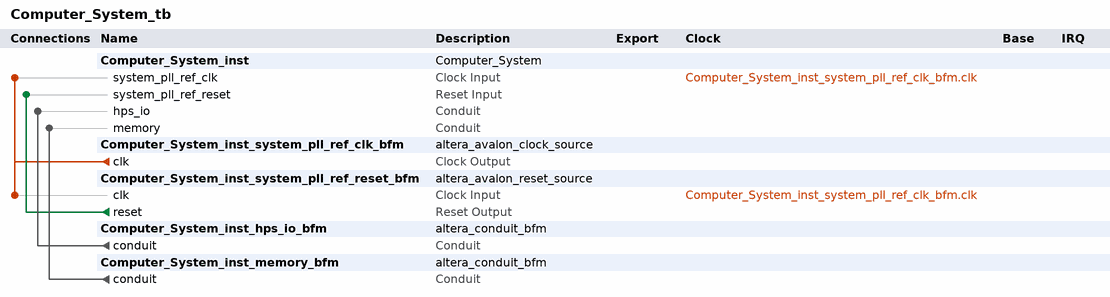
[diagram p0: system contents]
# Platform Designer (Qsys) system Computer_System_tb, Cyclone V 5CSEBA6U23I7
# Parameters at their usual value, and those the tool derives, are not listed.
package require -exact qsys 18.1
create_system Computer_System_tb
set_project_property DEVICE_FAMILY {Cyclone V}
set_project_property DEVICE 5CSEBA6U23I7

add_instance Computer_System_inst Computer_System 1.0

add_instance Computer_System_inst_system_pll_ref_clk_bfm altera_avalon_clock_source 18.1

add_instance Computer_System_inst_system_pll_ref_reset_bfm altera_avalon_reset_source 18.1
set_instance_parameter_value Computer_System_inst_system_pll_ref_reset_bfm ASSERT_HIGH_RESET 1
set_instance_parameter_value Computer_System_inst_system_pll_ref_reset_bfm INITIAL_RESET_CYCLES 50

add_instance Computer_System_inst_hps_io_bfm altera_conduit_bfm 18.1
set_instance_parameter_value Computer_System_inst_hps_io_bfm CLOCKED_SIGNAL false
set_instance_parameter_value Computer_System_inst_hps_io_bfm ENABLE_RESET false
set_instance_parameter_value Computer_System_inst_hps_io_bfm SIGNAL_DIRECTIONS input,bidir,output,output,output,output,output,output,input,input,input,input,input,input,bidir,bidir,bidir,bidir,bidir,bidir,bidir,bidir,bidir,bidir,input,bidir,bidir,bidir,bidir,bidir,input,output,input,input,output,input,output,bidir,bidir,bidir,bidir,bidir,bidir,bidir,bidir,output,output,input
set_instance_parameter_value Computer_System_inst_hps_io_bfm SIGNAL_ROLES hps_io_emac1_inst_MDC,hps_io_emac1_inst_MDIO,hps_io_emac1_inst_RXD0,hps_io_emac1_inst_RXD1,hps_io_emac1_inst_RXD2,hps_io_emac1_inst_RXD3,hps_io_emac1_inst_RX_CLK,hps_io_emac1_inst_RX_CTL,hps_io_emac1_inst_TXD0,hps_io_emac1_inst_TXD1,hps_io_emac1_inst_TXD2,hps_io_emac1_inst_TXD3,hps_io_emac1_inst_TX_CLK,hps_io_emac1_inst_TX_CTL,hps_io_gpio_inst_GPIO09,hps_io_gpio_inst_GPIO35,hps_io_gpio_inst_GPIO40,hps_io_gpio_inst_GPIO53,hps_io_gpio_inst_GPIO54,hps_io_gpio_inst_GPIO61,hps_io_i2c0_inst_SCL,hps_io_i2c0_inst_SDA,hps_io_i2c1_inst_SCL,hps_io_i2c1_inst_SDA,hps_io_sdio_inst_CLK,hps_io_sdio_inst_CMD,hps_io_sdio_inst_D0,hps_io_sdio_inst_D1,hps_io_sdio_inst_D2,hps_io_sdio_inst_D3,hps_io_spim1_inst_CLK,hps_io_spim1_inst_MISO,hps_io_spim1_inst_MOSI,hps_io_spim1_inst_SS0,hps_io_uart0_inst_RX,hps_io_uart0_inst_TX,hps_io_usb1_inst_CLK,hps_io_usb1_inst_D0,hps_io_usb1_inst_D1,hps_io_usb1_inst_D2,hps_io_usb1_inst_D3,hps_io_usb1_inst_D4,hps_io_usb1_inst_D5,hps_io_usb1_inst_D6,hps_io_usb1_inst_D7,hps_io_usb1_inst_DIR,hps_io_usb1_inst_NXT,hps_io_usb1_inst_STP
set_instance_parameter_value Computer_System_inst_hps_io_bfm SIGNAL_WIDTHS 1,1,1,1,1,1,1,1,1,1,1,1,1,1,1,1,1,1,1,1,1,1,1,1,1,1,1,1,1,1,1,1,1,1,1,1,1,1,1,1,1,1,1,1,1,1,1,1

add_instance Computer_System_inst_memory_bfm altera_conduit_bfm 18.1
set_instance_parameter_value Computer_System_inst_memory_bfm CLOCKED_SIGNAL false
set_instance_parameter_value Computer_System_inst_memory_bfm ENABLE_RESET false
set_instance_parameter_value Computer_System_inst_memory_bfm SIGNAL_DIRECTIONS input,input,input,input,input,input,input,input,bidir,bidir,bidir,input,input,input,input,output
set_instance_parameter_value Computer_System_inst_memory_bfm SIGNAL_ROLES mem_a,mem_ba,mem_cas_n,mem_ck,mem_ck_n,mem_cke,mem_cs_n,mem_dm,mem_dq,mem_dqs,mem_dqs_n,mem_odt,mem_ras_n,mem_reset_n,mem_we_n,oct_rzqin
set_instance_parameter_value Computer_System_inst_memory_bfm SIGNAL_WIDTHS 15,3,1,1,1,1,1,4,32,4,4,1,1,1,1,1

# connections
add_connection Computer_System_inst_system_pll_ref_clk_bfm.clk Computer_System_inst.system_pll_ref_clk clock
add_connection Computer_System_inst_system_pll_ref_clk_bfm.clk Computer_System_inst_system_pll_ref_reset_bfm.clk clock
add_connection Computer_System_inst_system_pll_ref_reset_bfm.reset Computer_System_inst.system_pll_ref_reset reset
add_connection Computer_System_inst_hps_io_bfm.conduit Computer_System_inst.hps_io conduit
add_connection Computer_System_inst_memory_bfm.conduit Computer_System_inst.memory conduit

set_interconnect_requirement {$system} qsys_mm.clockCrossingAdapter HANDSHAKE
set_interconnect_requirement {$system} qsys_mm.enableEccProtection FALSE
set_interconnect_requirement {$system} qsys_mm.insertDefaultSlave FALSE
set_interconnect_requirement {$system} qsys_mm.maxAdditionalLatency 1

save_system Computer_System_tb.qsys
